# Altium project PCB_Project1.PrjPCB
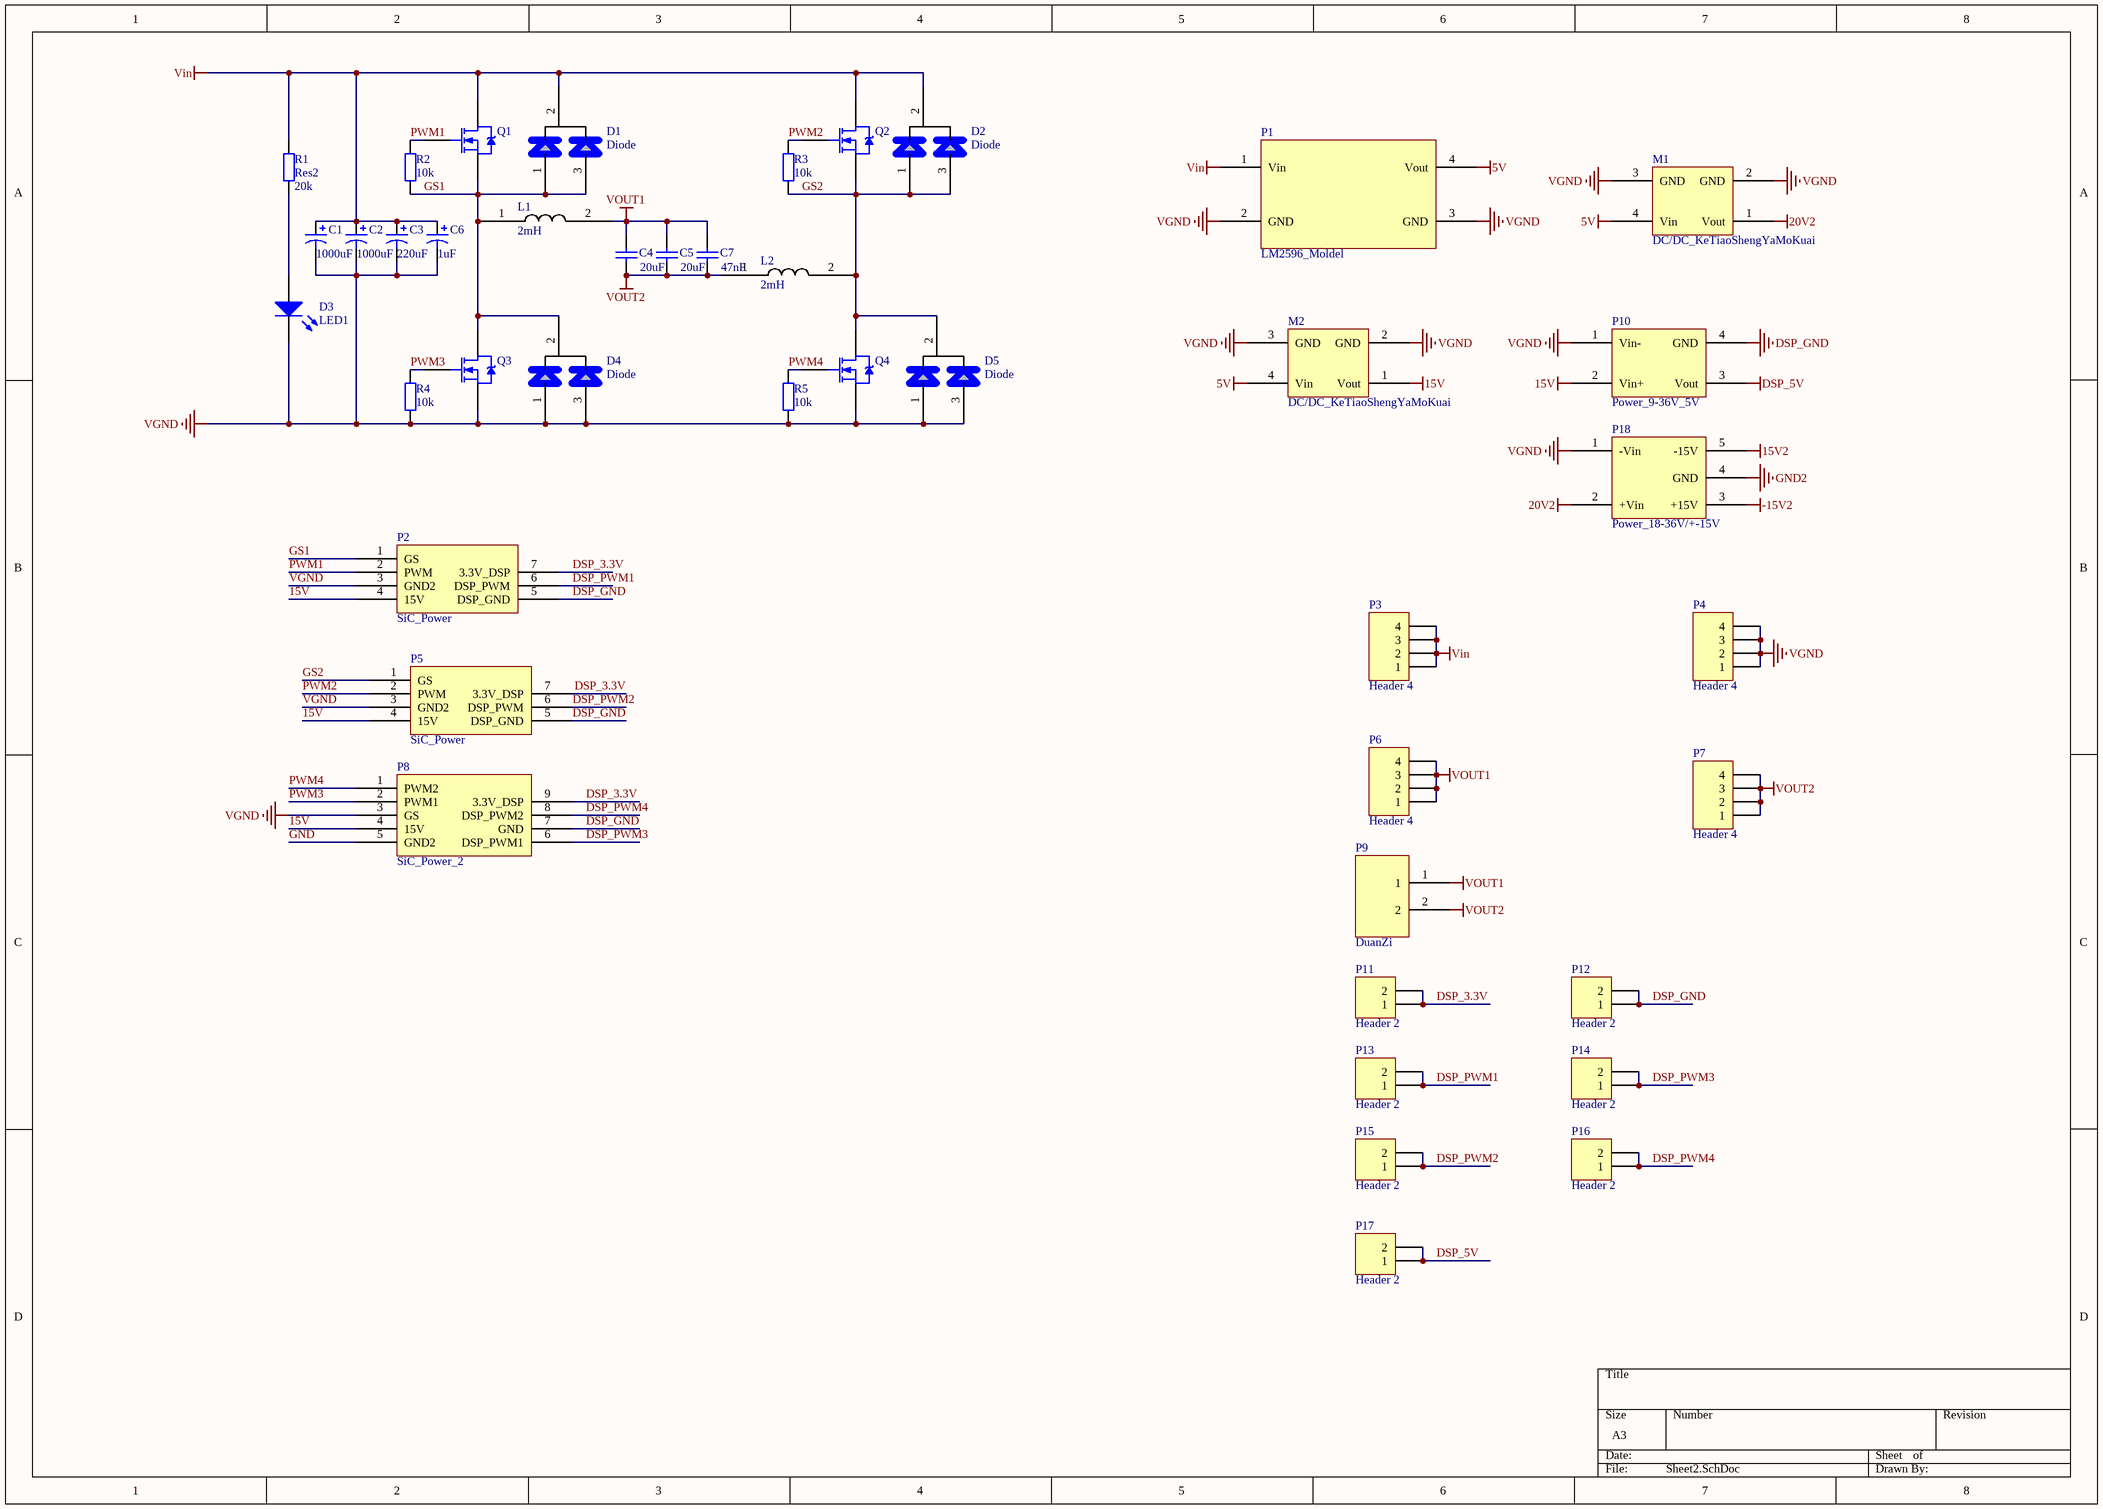
[diagram p0: Sheet2.SchDoc]
1 sheet, 43 parts. Net scope: global (net labels, ports and power ports of the same name join across sheets).
Board file: PCB1.PcbDoc

## Sheet Sheet2.SchDoc
size A3

### Parts
C1  value 1000uF  [C_1000uF_220uF]  (hidden comment: Cap Pol1)
C2  value 1000uF  [C_1000uF_220uF]  (hidden comment: Cap Pol1)
C3  value 220uF  [C_1000uF_220uF]  (hidden comment: Cap Pol1)
C4  value 20uF  [C_20uF_BaoMo]  (hidden comment: Cap Semi)
C5  value 20uF  [C_20uF_BaoMo]  (hidden comment: Cap Semi)
C6  value 1uF  [C_MKP_1uF]  (hidden comment: Cap Pol1)
C7  value 47nF  [C_0047_630_400_47nF]  (hidden comment: Cap Semi)
D1  Diode  [SiC-MOS]
D2  Diode  [SiC-MOS]
D3  LED1  [LED]
D4  Diode  [SiC-MOS]
D5  Diode  [SiC-MOS]
L1  2mH  [L_2mH]
L2  2mH  [L_2mH]
M1  DC/DC_KeTiaoShengYaMoKuai  [DC/DC-KeTiaoShengYaMoBan]
M2  DC/DC_KeTiaoShengYaMoKuai  [DC/DC-KeTiaoShengYaMoBan]
P1  LM2596_Moldel  [LM2596_Moldel]
P2  SiC_Power  [SiC_Power]
P3  Header 4  [HDR1X4]
P4  Header 4  [HDR1X4]
P5  SiC_Power  [SiC_Power]
P6  Header 4  [HDR1X4]
P7  Header 4  [HDR1X4]
P8  SiC_Power_2  [SiC_Power_2]
P9  DuanZi  [DuanZi]
P10  Power_9-36V_5V  [Power_9-36V/5V]
P11  Header 2  [HDR1X2]
P12  Header 2  [HDR1X2]
P13  Header 2  [HDR1X2]
P14  Header 2  [HDR1X2]
P15  Header 2  [HDR1X2]
P16  Header 2  [HDR1X2]
P17  Header 2  [HDR1X2]
P18  Power_18-36V/+-15V  [Power_18-36V/-+15V]
Q1  NMOS-2  [SiC-MOS]  (value not drawn)
Q2  NMOS-2  [SiC-MOS]  (value not drawn)
Q3  NMOS-2  [SiC-MOS]  (value not drawn)
Q4  NMOS-2  [SiC-MOS]  (value not drawn)
R1  Res2  value 20k  [R]
R2  value 10k  [AXIAL-0.4]  (hidden comment: Res2)
R3  value 10k  [AXIAL-0.4]  (hidden comment: Res2)
R4  value 10k  [AXIAL-0.4]  (hidden comment: Res2)
R5  value 10k  [AXIAL-0.4]  (hidden comment: Res2)

### Nets
5V: M1.4(Vin) M2.4(Vin) P1.4(Vout)
15V: M2.1(Vout) P2.4(15V) P5.4(15V) P8.4(15V) P10.2(Vin+)
15V2: P18.5(-15V)
20V2: M1.1(Vout) P18.2(+Vin)
-15V2: P18.3(+15V)
DSP_5V: P10.3(Vout) P17.1 P17.2
DSP_GND: P2.5(DSP_GND) P5.5(DSP_GND) P8.7(GND) P10.4(GND) P12.1 P12.2
GND2: P18.4(GND)
VGND: C1.2 C2.2 C3.2 C6.2 D3.2(K) D4.1 D4.3 D5.1 D5.3 M1.2(GND) M1.3(GND) M2.2(GND) M2.3(GND) P1.2(GND) P1.3(GND) P2.3(GND2) P4.1 P4.2 P4.3 P4.4 P5.3(GND2) P8.3(GS) P10.1(Vin-) P18.1(-Vin) Q3.3(S) Q4.3(S) R4.1 R5.1
Vin: C1.1 C2.1 C3.1 C6.1 D1.2 D2.2 P1.1(Vin) P3.1 P3.2 P3.3 P3.4 Q1.2(D) Q2.2(D) R1.1
VOUT1: C4.2 C5.2 C7.2 L1.2 P6.1 P6.2 P6.3 P6.4 P9.1
VOUT2: C4.1 C5.1 C7.1 L2.1 P7.1 P7.2 P7.3 P7.4 P9.2
DSP_3.3V: P2.7(3.3V_DSP) P5.7(3.3V_DSP) P8.9(3.3V_DSP) P11.1 P11.2
DSP_PWM1: P2.6(DSP_PWM) P13.1 P13.2
DSP_PWM2: P5.6(DSP_PWM) P15.1 P15.2
DSP_PWM3: P8.6(DSP_PWM1) P14.1 P14.2
DSP_PWM4: P8.8(DSP_PWM2) P16.1 P16.2
GND: P8.5(GND2)
GS1: D1.1 D1.3 D4.2 L1.1 P2.1(GS) Q1.3(S) Q3.2(D) R2.1
GS2: D2.1 D2.3 D5.2 L2.2 P5.1(GS) Q2.3(S) Q4.2(D) R3.1
PWM1: P2.2(PWM) Q1.1(G) R2.2
PWM2: P5.2(PWM) Q2.1(G) R3.2
PWM3: P8.2(PWM1) Q3.1(G) R4.2
PWM4: P8.1(PWM2) Q4.1(G) R5.2
NetD3_1: D3.1(A) R1.2

### Library data of the parts
C1-C3 C6 = Cap Pol1: Polarized Capacitor (Radial); Published: 8-Jun-2000; LatestRevisionDate: 17-Jul-2002; LatestRevisionNote: Re-released for DXP Platform.; PackageReference: RB7.6-15; Publisher: Altium Limited; PackageDescription: Polarized Capacitor (Radial); 2 Leads
C4 C5 C7 = Cap Semi: Capacitor (Semiconductor SIM Model); Published: 8-Jun-2000; LatestRevisionDate: 29-May-2009; LatestRevisionNote: IPC-7351 Footprint Added.; PackageReference: C1206; Publisher: Altium Limited; PackageDescription: Chip Capacitor
D3 = LED1: Typical RED GaAs LED; Published: 8-Jun-2000; LatestRevisionDate: 08-Jul-2005; LatestRevisionNote: Mech Layer 1 removed.; PackageReference: LED-1; Publisher: Altium Limited; PackageDescription: LED; 2 Leads
L1 L2 = L
P3 P4 P6 P7 = Header 4: Header, 4-Pin; LatestRevisionDate: 17-Jul-2002; LatestRevisionNote: Re-released for DXP Platform.; Publisher: Altium Limited
P11-P17 = Header 2: Header, 2-Pin; LatestRevisionDate: 17-Jul-2002; LatestRevisionNote: Re-released for DXP Platform.; Publisher: Altium Limited
Q1-Q4 = NMOS-2: N-Channel Power MOSFET; Note: Pin 2 is electrically connected to pin 4.; Published: 8-Jun-2000; LatestRevisionDate: 17-Jul-2002; LatestRevisionNote: Re-released for DXP Platform.; DatasheetVersion: PD-9.814; PackageVersion: Feb-1997; PackageReference: TO-220AB; Publisher: Altium Limited; PackageDescription: TO, Thru-Hole, Vertical, Heatsink Mounted; 3 In-Line Leads; Pitch 2.54 mm; ComponentLink1Description: Manufacturer Link; ComponentLink1URL: http://www.irf.com/
R1-R5 = Res2: Resistor; Published: 8-Jun-2000; LatestRevisionDate: 17-Jul-2002; LatestRevisionNote: Re-released for DXP Platform.; PackageReference: AXIAL-0.4; Publisher: Altium Limited; PackageDescription: Axial Device, Thru-Hole; 2 Leads; 0.4 in Pin Spacing